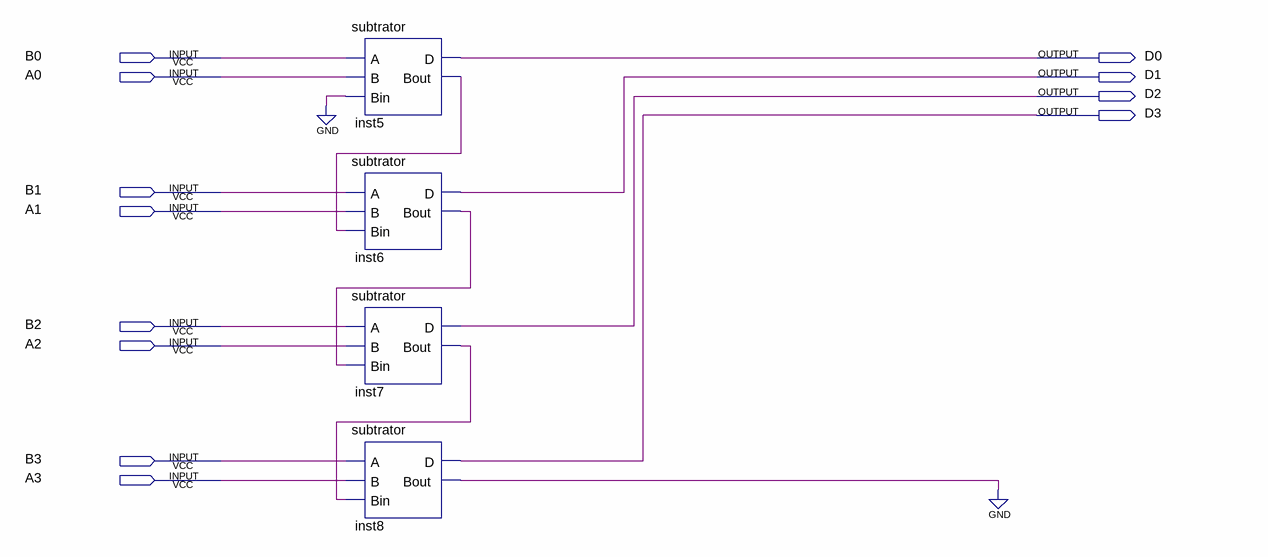
[diagram p0: schematic sheet]
// Quartus schematic sub4.bdf as structural Verilog: 4 symbols, 12 pins
module sub4 (
  input  B0,
  input  A0,
  input  B1,
  input  A1,
  input  B2,
  input  A2,
  input  B3,
  input  A3,
  output D0,
  output D1,
  output D2,
  output D3
);

  wire inst5_bout, inst6_bout, inst7_bout, inst8_bout;

  subtrator inst5 (.A(B0), .B(A0), .Bin(1'b0), .D(D0), .Bout(inst5_bout));
  subtrator inst6 (.A(B1), .B(A1), .Bin(inst5_bout), .D(D1), .Bout(inst6_bout));
  subtrator inst7 (.A(B2), .B(A2), .Bin(inst6_bout), .D(D2), .Bout(inst7_bout));
  subtrator inst8 (.A(B3), .B(A3), .Bin(inst7_bout), .D(D3), .Bout(inst8_bout));
  // also tied to GND on the sheet: inst8_bout
endmodule
